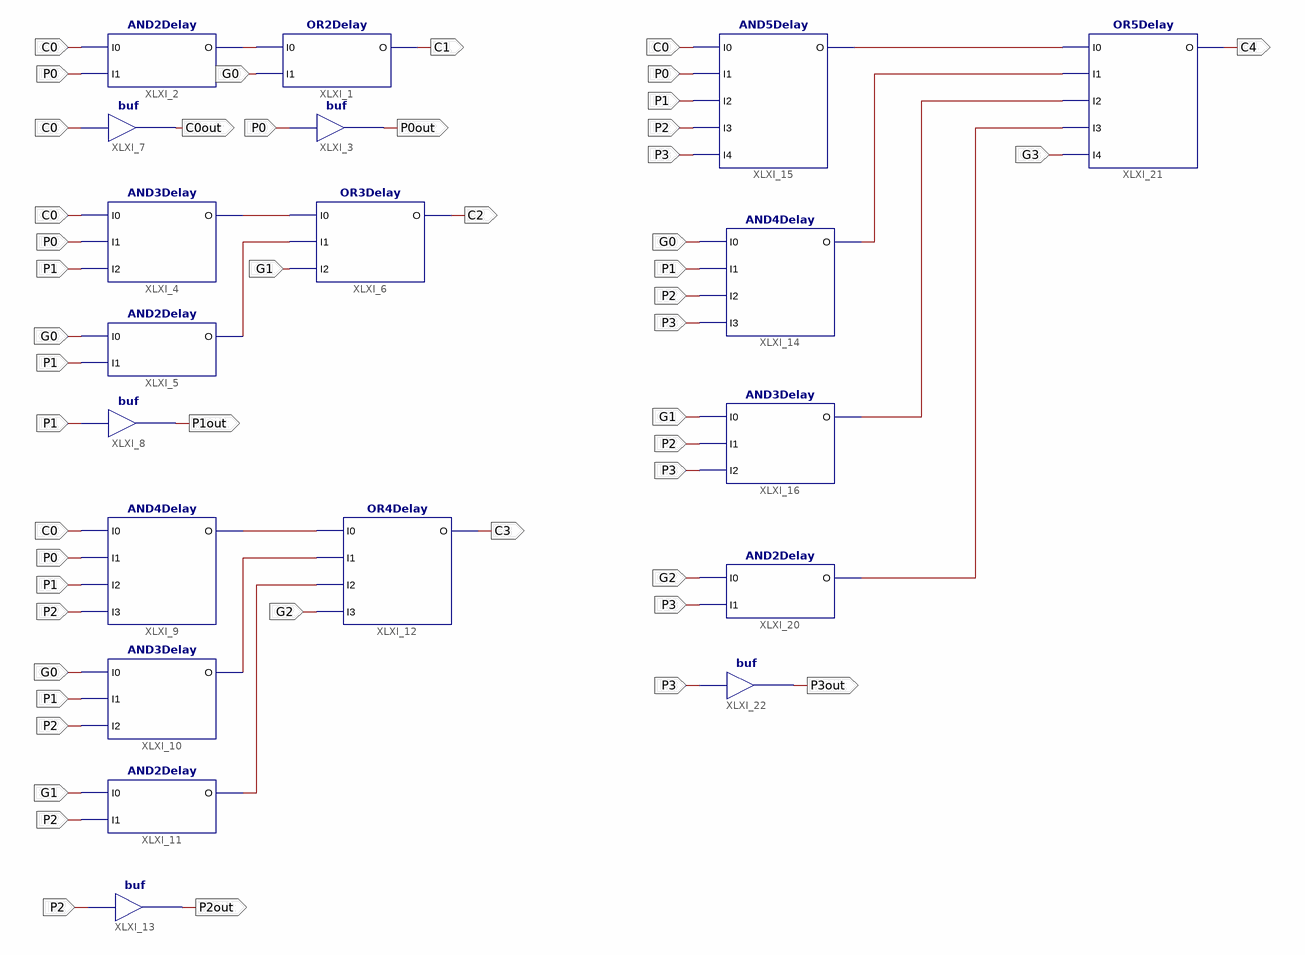
[diagram p0: schematic sheet 1]
// Xilinx ISE schematic CarryLookAheadLogicBlock.sch (spartan6) as structural Verilog: 19 symbols, 18 ports
module CarryLookAheadLogicBlock (
  input  C0,
  input  P0,
  input  G0,
  input  G1,
  input  P1,
  input  P2,
  input  G2,
  input  P3,
  input  G3,
  output C1,
  output C0out,
  output P0out,
  output C2,
  output P1out,
  output C3,
  output P2out,
  output C4,
  output P3out
);

  wire XLXN_1, XLXN_10, XLXN_11, XLXN_21, XLXN_22, XLXN_23, XLXN_37, XLXN_38, XLXN_39, XLXN_40;

  OR2Delay XLXI_1 (.I0(XLXN_1), .I1(G0), .O(C1));
  AND2Delay XLXI_2 (.I0(C0), .I1(P0), .O(XLXN_1));
  buf XLXI_3 (P0out, P0);
  AND3Delay XLXI_4 (.I0(C0), .I1(P0), .I2(P1), .O(XLXN_10));
  AND2Delay XLXI_5 (.I0(G0), .I1(P1), .O(XLXN_11));
  OR3Delay XLXI_6 (.I0(XLXN_10), .I1(XLXN_11), .I2(G1), .O(C2));
  buf XLXI_7 (C0out, C0);
  buf XLXI_8 (P1out, P1);
  AND4Delay XLXI_9 (.I0(C0), .I1(P0), .I2(P1), .I3(P2), .O(XLXN_21));
  AND3Delay XLXI_10 (.I0(G0), .I1(P1), .I2(P2), .O(XLXN_23));
  AND2Delay XLXI_11 (.I0(G1), .I1(P2), .O(XLXN_22));
  OR4Delay XLXI_12 (.I0(XLXN_21), .I1(XLXN_23), .I2(XLXN_22), .I3(G2), .O(C3));
  buf XLXI_13 (P2out, P2);
  AND4Delay XLXI_14 (.I0(G0), .I1(P1), .I2(P2), .I3(P3), .O(XLXN_38));
  AND5Delay XLXI_15 (.I0(C0), .I1(P0), .I2(P1), .I3(P2), .I4(P3), .O(XLXN_37));
  AND3Delay XLXI_16 (.I0(G1), .I1(P2), .I2(P3), .O(XLXN_39));
  AND2Delay XLXI_20 (.I0(G2), .I1(P3), .O(XLXN_40));
  OR5Delay XLXI_21 (.I0(XLXN_37), .I1(XLXN_38), .I2(XLXN_39), .I3(XLXN_40), .I4(G3), .O(C4));
  buf XLXI_22 (P3out, P3);
endmodule
